# Altium schematic sheet CAN.SchDoc: =DocumentName
size A4; Organization: Queen's Formula SAE; Address1: 130 Stuart St, Kingston; Address2: Ontario; Address3: Canada; Address4: K7L 2V9; DocumentNumber: 1; Revision: 0; SheetNumber: 1; SheetTotal: 1
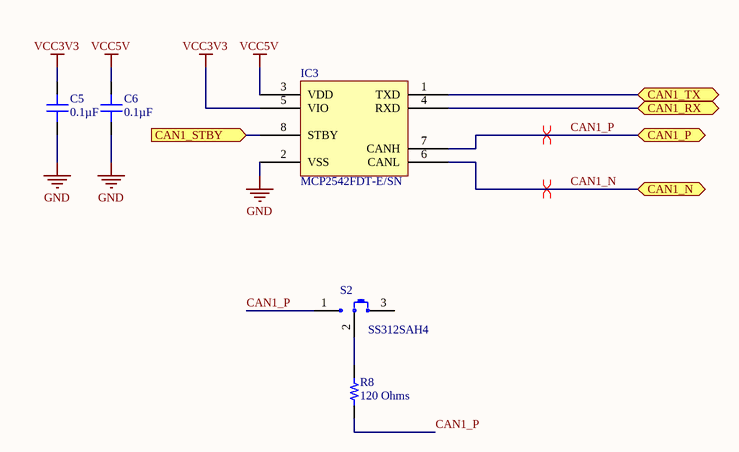
[diagram p0: CAN.SchDoc]

## Parts
C5  0.1µF  [CAP 0201_0603]
C6  0.1µF  [CAP 0201_0603]
IC3  MCP2542FDT-E/SN  [MICROCHIP SOIC-8 150MIL WIDE]
R8  120 Ohms  [RES 0402_1005]
S2  SS312SAH4  [NKK SS312SAH4]

## Ports
CAN1_N (bidir), CAN1_P (bidir), CAN1_RX (bidir), CAN1_STBY (in), CAN1_TX (bidir)

## Nets
GND: C5.1 C6.1 IC3.2(VSS)
VCC3V3: C5.2 IC3.5(VIO)
VCC5V: C6.2 IC3.3(VDD)
CAN1_N: IC3.6(CANL) ; port CAN1_N
CAN1_P: IC3.7(CANH) R8.1 S2.1 ; port CAN1_P
CAN1_RX: IC3.4(RXD) ; port CAN1_RX
CAN1_STBY: IC3.8(STBY) ; port CAN1_STBY
CAN1_TX: IC3.1(TXD) ; port CAN1_TX
NetR8_2: R8.2 S2.2(COM)

Not connected (* = marked no-connect by the designer): S2 3

## Layout directives
differential pair: CAN1_N, CAN1_P

## Notes on the sheet
- Title
- Size:
- Date:
- A4
- Number:
- Time:
- Revision:
- Sheet
- of
- File:

## Library data of the parts
C5 C6 = EMK063BJ104KP-F: CAP CER 0.1UF 16V X5R 0201; Manufacturer: Taiyo Yuden; Tolerance: ±10%; Part Number: EMK063BJ104KP-F; Value: 0.1µF; Applications: General Purpose; Capacitance: 0.1µF; ComponentLink1Description: Datasheet; ComponentLink1URL: https://ds.yuden.co.jp/TYCOMPAS/ut/detail?pn=EMK063BJ104KP-F  &u=M; ComponentLink2Description: DigiKey Link; ComponentLink2URL: http://digikey.com/product-detail/en/taiyo-yuden/EMK063BJ104KP-F/587-5833-1-ND/7674954; Device Package: 0201 (0603 Metric); LastUpdated: 2020-09-02 1:00:18 AM; Lifecycle Status: Active; Minimum Order: 1; Mounting Type: Surface Mount, MLCC; Operating Temperature: -55°C ~ 85°C; Package / Case: 0201 (0603 Metric); Packaging: TapeAndReel; PartId: 12; Part Status: Active; Price: 0.02; Series: M; Size / Dimension: 0.024" L x 0.012" W (0.60mm x 0.30mm); Supplier 1: DigiKey; Supplier Part Number 1: 587-5833-1-ND; Temperature Coefficient: X5R; Thickness (Max): 0.013" (0.33mm); Voltage - Rated: 16V
IC3 = MCP2542FDT-E/SN: IC TRANSCEIVER 1/1 8SOIC; Manufacturer: Microchip Technology; Data Rate: 8Mbps; Protocol: CANbus; Receiver Hysteresis: 200mV; Voltage - Supply: 4.5V ~ 5.5V; Part Number: MCP2542FDT-E/SN; ComponentLink1Description: Datasheet; ComponentLink1URL: http://www.microchip.com/mymicrochip/filehandler.aspx?ddocname=en585412; ComponentLink2Description: DigiKey Link; ComponentLink2URL: http://digikey.com/product-detail/en/microchip-technology/MCP2542FDT-E-SN/MCP2542FDT-E-SNCT-ND/9642863; Device Package: 8-SOIC (0.154", 3.90mm Width); LastUpdated: 2020-05-24 11:07:13 PM; Lifecycle Status: Active; Minimum Order: 1; Mounting Type: Surface Mount; Number of Drivers/Receivers: 1/1; Operating Temperature: -40°C ~ 125°C; Package / Case: 8-SOIC (0.154", 3.90mm Width); Packaging: TapeAndReel; Part Status: Active; Price: 0.59; Series: -; Supplier 1: DigiKey; Supplier Part Number 1: MCP2542FDT-E/SNCT-ND; Supplier Device Package: 8-SOIC; Type: Transceiver
R8 = RC0402JR-07120RL: RES SMD 120 OHM 5% 1/16W 0402; Manufacturer: Yageo; Power (Watts): 0.063W, 1/16W; Temperature Coefficient: ±100ppm/°C; Part Number: RC0402JR-07120RL; Value: 120 Ohms; ComponentLink1Description: Datasheet; ComponentLink1URL: https://www.yageo.com/upload/media/product/productsearch/datasheet/rchip/PYu-RC_Group_51_RoHS_L_10.pdf; ComponentLink2Description: DigiKey Link; ComponentLink2URL: http://digikey.com/product-detail/en/yageo/RC0402JR-07120RL/311-120JRCT-ND/2827967; Composition: Thick Film; Device Package: 0402 (1005 Metric); Features: Moisture Resistant; Height - Seated (Max): 0.016" (0.40mm); LastUpdated: 2020-09-02 1:08:05 AM; Lifecycle Status: Active; Minimum Order: 1; Number of Terminations: 2; Operating Temperature: -55°C ~ 155°C; Package / Case: 0402 (1005 Metric); Packaging: CutTape; PartId: 4797; Part Status: Active; Price: 0.10; Resistance: 120 Ohms; Series: RC; Size / Dimension: 0.039" L x 0.020" W (1.00mm x 0.50mm); Supplier 1: DigiKey; Supplier Part Number 1: 311-120JRCT-ND; Supplier Device Package: 0402; Tolerance: ±5%
S2 = SS312SAH4: SWITCH SLIDE SPDT 0.4VA 28V; Manufacturer: NKK Switches; Actuator Length: 2.00mm; Actuator Type: Standard; Contact Timing: Shorting (MBB); Current Rating (Amps): 0.4VA (AC/DC); Switch Function: On-On; Part Number: SS312SAH4; Circuit: SPDT; ComponentLink1Description: Datasheet; ComponentLink1URL: http://www.nkkswitches.com/pdf/SS3surfaceMount-1.pdf; ComponentLink2Description: DigiKey Link; ComponentLink2URL: http://digikey.com/product-detail/en/nkk-switches/SS312SAH4/360-3250-ND/1052031; Contact Finish: Gold; Contact Material: Phosphor Bronze; LastUpdated: 2020-01-04 7:15:23 PM; Lifecycle Status: Active; Minimum Order: 1; Mounting Type: Surface Mount, Right Angle; Operating Temperature: -25°C ~ 85°C; Packaging: Tray; PartId: 2; Part Status: Active; Price: 3.02; Series: SS3; Supplier 1: DigiKey; Supplier Part Number 1: 360-3250-ND; Termination Style: Gull Wing; Voltage Rating - AC: 28V; Voltage Rating - DC: 28V